# EAGLE design Bleasy (EAGLE 6.5.0)
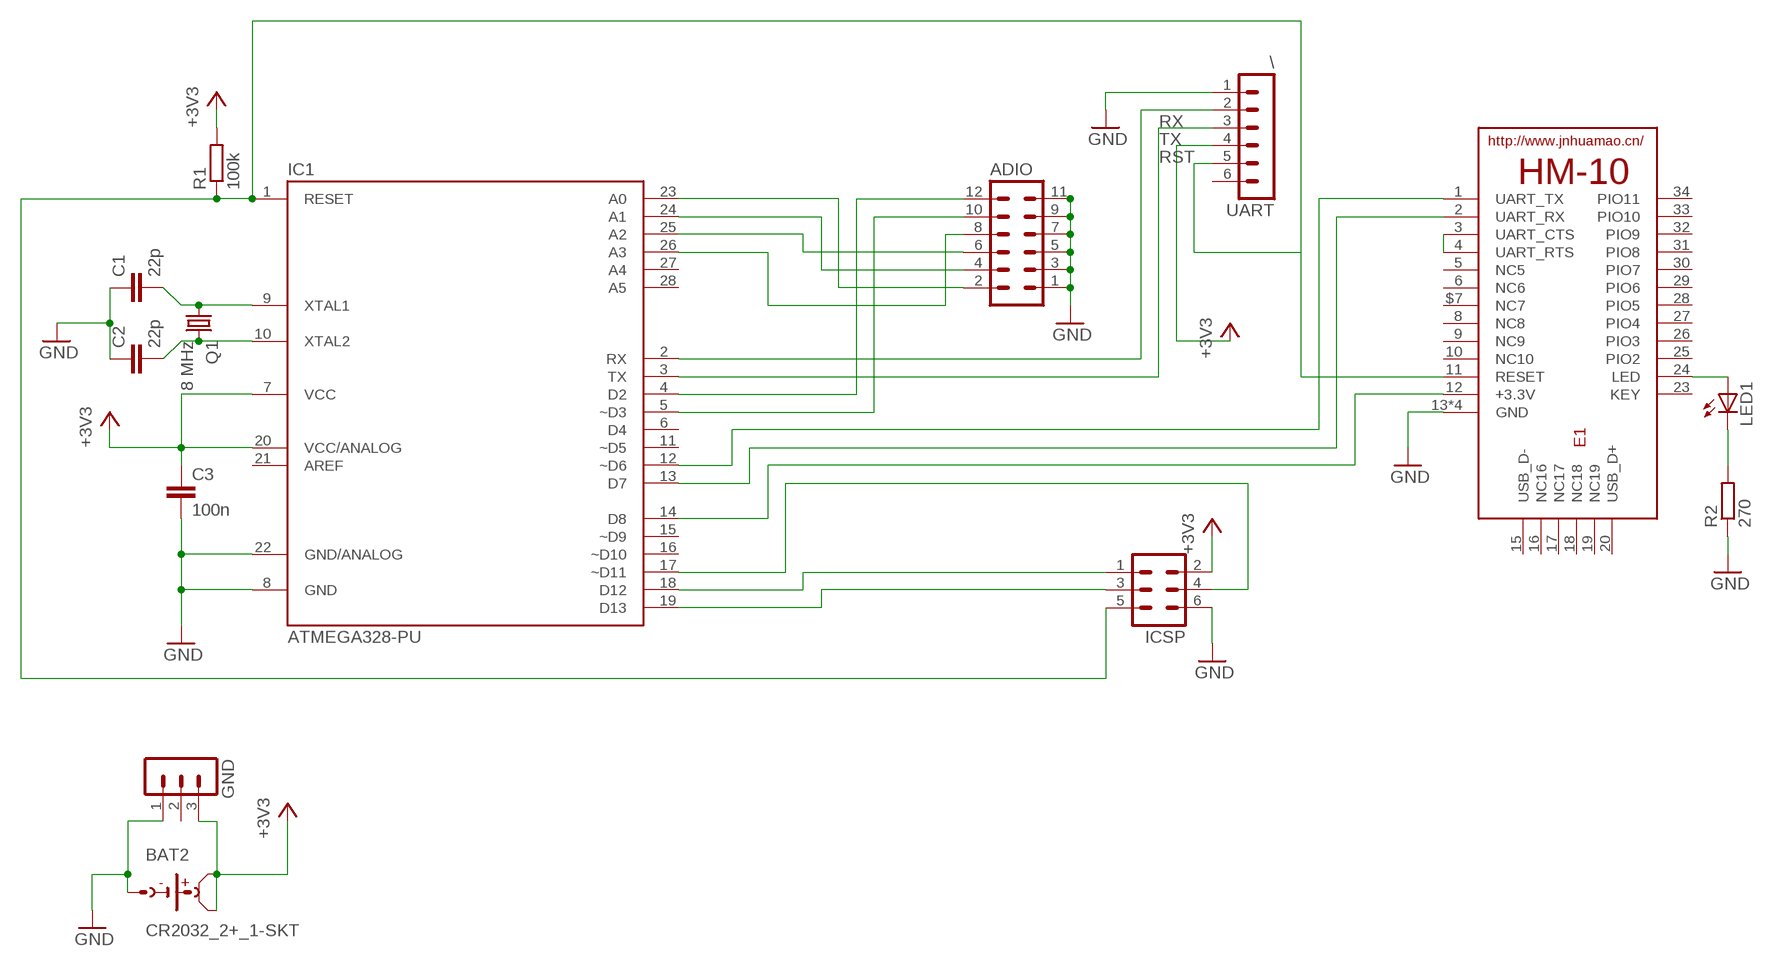
[diagram p0: schematic, sheet 1]

## Parts
ADIO  MA06-2  [MA06-2]
BAT2  CR2032_2+_1-SKT  [CR2032-SOCKET-THT]
C1  22p  C-EU025-025X050  [C025-025X050]
C2  22p  C-EU025-025X050  [C025-025X050]
C3  100n  C-EU025-025X050  [C025-025X050]
E1  HM-10-BOARD  [26.9X13X2.2_BOARD]
GND  MA03-1  [MA03-1]
IC1  ATMEGA328-PU  [DIL28-3]
ICSP  MA03-2  [MA03-2]
LED1  LED3MM  [LED3MM]
Q1  8 MHz  CRYSTALHC49U70  [HC49U70]
R1  100k  R-EU_R1206  [R1206]
R2  270  R-EU_R1206  [R1206]
UART  \  MA06-1  [MA06-1]

## Nets
+3V3: BAT2.2(POS2) BAT2.3(POS1) C3.1 GND.3 IC1.7(VCC) IC1.20(VCC/ANALOG) ICSP.2 R1.2 UART.4
GND: ADIO.1 ADIO.3 ADIO.5 ADIO.7 ADIO.9 ADIO.11 BAT2.1(NEG) C1.1 C2.1 C3.2 E1.13(GND) E1.14(GND) E1.21(GND) E1.22(GND) GND.1 IC1.8(GND) IC1.22(GND/ANALOG) ICSP.6 R2.1 UART.1
HM10_RX: E1.2(UART_RX) IC1.13(D7)
HM10_TX: E1.1(UART_TX) IC1.12(~D6)
MISO: IC1.18(D12) ICSP.1
N$1: C2.2 IC1.10(XTAL2) Q1.2
N$2: C1.2 IC1.9(XTAL1) Q1.1
N$3: IC1.17(~D11) ICSP.4
N$4: ADIO.12 IC1.4(D2)
N$5: ADIO.10 IC1.5(~D3)
N$6: E1.24(LED) LED1.A
N$7: LED1.K(C) R2.2
N$8: E1.12(+3.3V) IC1.14(D8)
N$9: ADIO.2 IC1.23(A0)
N$10: ADIO.4 IC1.24(A1)
N$11: ADIO.6 IC1.25(A2)
N$12: ADIO.8 IC1.26(A3)
N$13: E1.3(UART_CTS) E1.4(UART_RTS)
RST: E1.11(RESET) IC1.1(RESET) ICSP.5 R1.1 UART.5
RX: IC1.2(RX) UART.2
SCK: IC1.19(D13) ICSP.3
TX: IC1.3(TX) UART.3
Unconnected: E1.5(NC5) E1.6(NC6) E1.8(NC8) E1.9(NC9) E1.10(NC10) E1.15(USB_D-) E1.16(NC16) E1.17(NC17) E1.18(NC18) E1.19(NC19) E1.20(USB_D+) E1.23(KEY) E1.25(PIO2) E1.26(PIO3) E1.27(PIO4) E1.28(PIO5) E1.29(PIO6) E1.30(PIO7) E1.31(PIO8) E1.32(PIO9) E1.33(PIO10) E1.34(PIO11) E1.$7(NC7) GND.2 IC1.6(D4) IC1.11(~D5) IC1.15(~D9) IC1.16(~D10) IC1.21(AREF) IC1.27(A4) IC1.28(A5) UART.6

## Library data of the parts
ADIO = con-lstb:MA06-2: PIN HEADER; OC_FARNELL: unknown; OC_NEWARK: unknown
BAT2 = con_bat_2032__s_:CR2032_2+_1-
C1-C3 = rcl:C-EU: CAPACITOR, European symbol
E1 = JNHuaMao:HM-10: HM Bluetooth module use TI CC2540 or CC2541, Master and slave roles in one, transmission version and remote control version and PIO state acquisition functions in one, Support the AT command modify module parameters, Convenient and flexible.
GND = con-lstb:MA03-1: PIN HEADER; OC_FARNELL: unknown; OC_NEWARK: unknown
IC1 = ATMEGA328P:ATMEGA328-PU
ICSP = con-lstb:MA03-2: PIN HEADER; OC_FARNELL: unknown; OC_NEWARK: unknown
LED1 = led:LED: LED OSRAM: - CHIPLED LG R971, LG N971, LY N971, LG Q971, LY Q971, LO R971, LY R971 LH N974, LH R974 LS Q976, LO Q976, LY Q976 LO Q996 - Hyper CHIPLED LW Q18S LB Q993, LB Q99A, LB R99A - SideLED LS A670, LO A670, LY A670, LG A670, LP A670 LB A673, LV A673, LT A673, LW A673 LH A674 LY A675 LS A676, LA A676, LO A676, LY A676, LW A676 LS A679, LY A679, LG A679 - Hyper Micro SIDELED® LS Y876, LA Y876, LO Y876, LY Y876 LT Y87S - SmartLED LW L88C, LW L88S LB L89C, LB L89S, LG L890 LS L89K, LO L89K, LY L89K LS L896, LA L896, LO L896, LY L896 - TOPLED LS T670, LO T670, LY T670, LG T670, LP T670 LSG T670, LSP T670, LSY T670, LOP T670, LYG T670 LG T671, LOG T671, LSG T671 LB T673, LV T673, LT T673, LW T673 LH T674 LS T676, LA T676, LO T676, LY T676, LB T676, LH T676, LSB T676, LW T676 LB T67C, LV T67C, LT T67C, LS T67K, LO T67K, LY T67K, LW E67C LS E67B, LA E67B, LO E67B, LY E67B, LB E67C, LV E67C, LT E67C LW T67C LS T679, LY T679, LG T679 LS T770, LO T770, LY T770, LG T770, LP T770 LB T773, LV T773, LT T773, LW T773 LH T774 LS E675, LA E675, LY E675, LS T675 LS T776, LA T776, LO T776, LY T776, LB T776 LHGB T686 LT T68C, LB T68C - Hyper Mini TOPLED® LB M676 - Mini TOPLED Santana® LG M470 LS M47K, LO M47K, LY M47K Source: http://www.osram.convergy.de LUXEON: - LUMILED® LXK2-PW12-R00, LXK2-PW12-S00, LXK2-PW14-U00, LXK2-PW14-V00 LXK2-PM12-R00, LXK2-PM12-S00, LXK2-PM14-U00 LXK2-PE12-Q00, LXK2-PE12-R00, LXK2-PE12-S00, LXK2-PE14-T00, LXK2-PE14-U00 LXK2-PB12-K00, LXK2-PB12-L00, LXK2-PB12-M00, LXK2-PB14-N00, LXK2-PB14-P00, LXK2-PB14-Q00 LXK2-PR12-L00, LXK2-PR12-M00, LXK2-PR14-Q00, LXK2-PR14-R00 LXK2-PD12-Q00, LXK2-PD12-R00, LXK2-PD12-S00 LXK2-PH12-R00, LXK2-PH12-S00 LXK2-PL12-P00, LXK2-PL12-Q00, LXK2-PL12-R00 Source: www.luxeon.com KINGBRIGHT: KA-3528ASYC Source: www.kingbright.com
Q1 = crystal:CRYSTAL: CRYSTAL; OC_FARNELL: unknown; OC_NEWARK: unknown
R1 R2 = resistor:R-EU_: RESISTOR, European symbol
UART = con-lstb:MA06-1: PIN HEADER; OC_FARNELL: unknown; OC_NEWARK: unknown

## Board
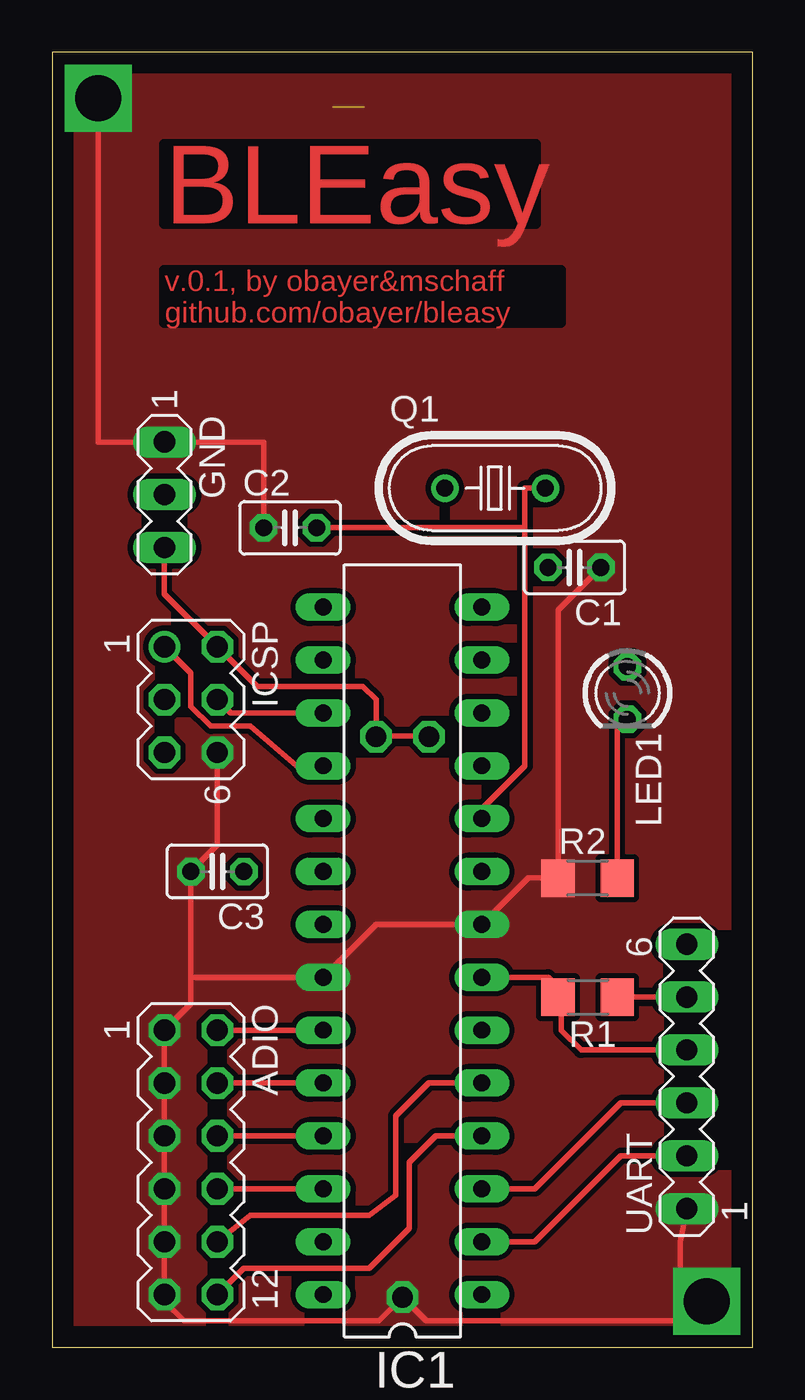
[diagram p1: board, top side]
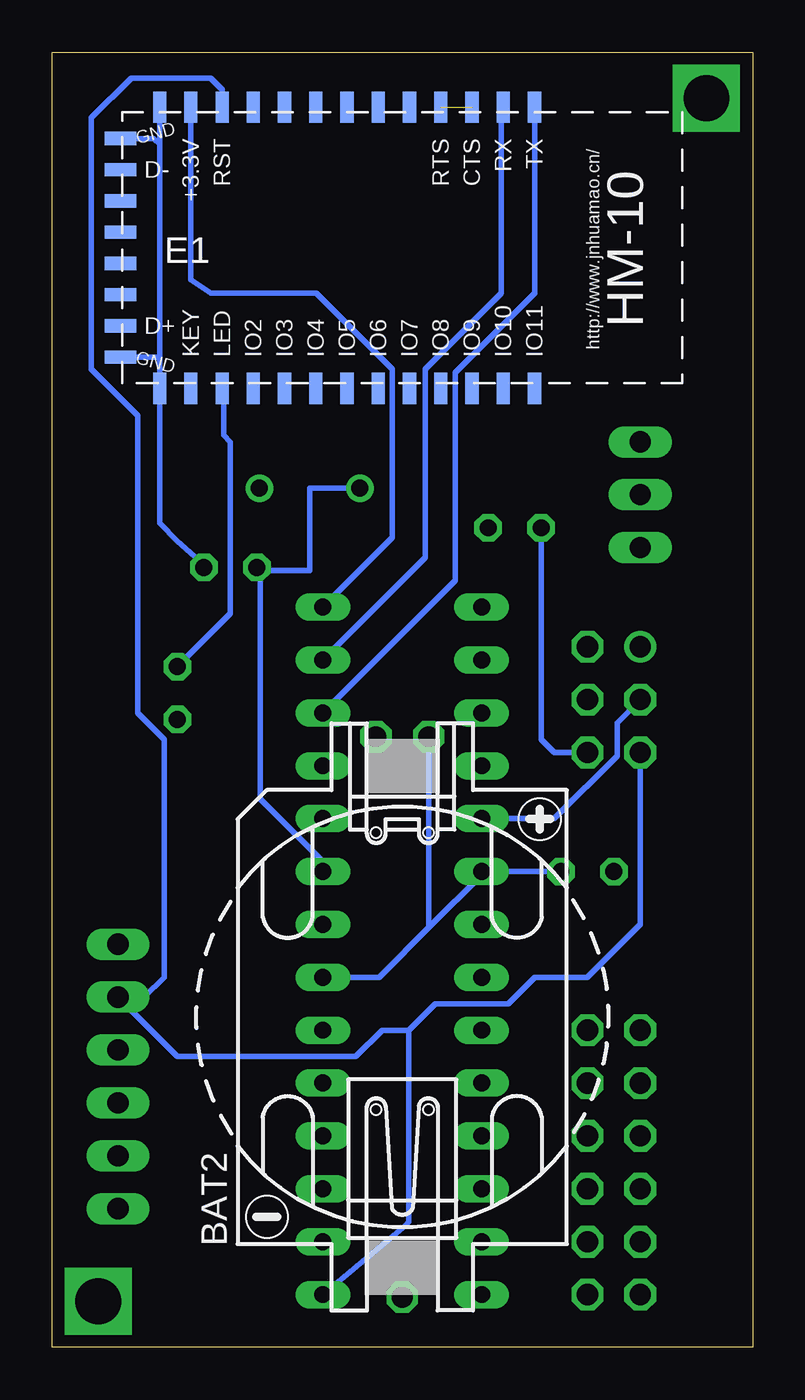
[diagram p2: board, bottom side, seen from below]

Size 33.64 x 62.22 mm. Coordinates in mm from the lower left corner, seen from the top.
Outline: 0,0 33.64,0 33.64,62.22 0,62.22 0,0
Copper layers (1*16): Top 0.035mm / dielectric 1.5mm / Bottom 0.035mm
Design rules "default": minimum track width 10mil, minimum drill 24mil, track to track 8mil, track to pad 8mil, pad to pad 8mil, via to via 8mil, smd to smd 8mil, copper to edge 40mil, drill to drill 8mil, minimum pad ring 10mil, minimum via ring 8mil, stop-mask expansion 4mil, vias tented up to drill 0mil, thermal gap 10mil

### Footprints (pad centres in the part's own frame; a part is rotated, then mirrored left to right if it is on the bottom)
MA06-2 = drill 1.016 octagon: 1 -6.35,-1.27; 2 -6.35,1.27; 3 -3.81,-1.27; 4 -3.81,1.27; 5 -1.27,-1.27; 6 -1.27,1.27; 7 1.27,-1.27; 8 1.27,1.27; 9 3.81,-1.27; 10 3.81,1.27; 11 6.35,-1.27; 12 6.35,1.27
CR2032-SOCKET-THT = drill 1 octagon: 1 -13.462,0; 2 13.462,-1.27; 3 13.462,1.27
C025-025X050 = drill 0.813 octagon: 1 -1.27,0; 2 1.27,0
26.9X13X2.2_BOARD = smd 1.5 x 0.635: 1 -7.5,0; 2 -7.5,-1.5; 3 -7.5,-3; 4 -7.5,-4.5; 5 -7.5,-6; 6 -7.5,-7.5; 8 -7.5,-10.5; 9 -7.5,-12; 10 -7.5,-13.5; 11 -7.5,-15; 12 -7.5,-16.5; 13 -7.5,-18; 22 6,-18; 23 6,-16.5; 24 6,-15; 25 6,-13.5; 26 6,-12; 27 6,-10.5; 28 6,-9; 29 6,-7.5; 30 6,-6; 31 6,-4.5; 32 6,-3; 33 6,-1.5; 34 6,0; $7 -7.5,-9 | smd 0.635 x 1.5: 14 -6,-19.875; 15 -4.5,-19.875; 16 -3,-19.875; 17 -1.5,-19.875; 18 0,-19.875; 19 1.5,-19.875; 20 3,-19.875; 21 4.5,-19.875
MA03-1 = drill 1.016 long: 1 -2.54,0; 2 0,0; 3 2.54,0
DIL28-3 = drill 0.813 long: 1 -16.51,-3.81; 2 -13.97,-3.81; 3 -11.43,-3.81; 4 -8.89,-3.81; 5 -6.35,-3.81; 6 -3.81,-3.81; 7 -1.27,-3.81; 8 1.27,-3.81; 9 3.81,-3.81; 10 6.35,-3.81; 11 8.89,-3.81; 12 11.43,-3.81; 13 13.97,-3.81; 14 16.51,-3.81; 15 16.51,3.81; 16 13.97,3.81; 17 11.43,3.81; 18 8.89,3.81; 19 6.35,3.81; 20 3.81,3.81; 21 1.27,3.81; 22 -1.27,3.81; 23 -3.81,3.81; 24 -6.35,3.81; 25 -8.89,3.81; 26 -11.43,3.81; 27 -13.97,3.81; 28 -16.51,3.81
MA03-2 = drill 1.016: 1 -2.54,-1.27 | drill 1.016 octagon: 2 -2.54,1.27; 3 0,-1.27; 4 0,1.27; 5 2.54,-1.27; 6 2.54,1.27
LED3MM = drill 0.813 octagon: A -1.27,0; K 1.27,0
HC49U70 = drill 0.813: 1 -2.413,0; 2 2.413,0
R1206 = smd 1.6 x 1.803: 1 -1.422,0; 2 1.422,0
MA06-1 = drill 1.016 long: 1 -6.35,0; 2 -3.81,0; 3 -1.27,0; 4 1.27,0; 5 3.81,0; 6 6.35,0

### Placement (x,y rotation side)
ADIO  6.67,8.89 270 top
BAT2  16.83,15.88 90 bottom
C1  25.08,37.47 180 top
C2  11.43,39.37 0 top
C3  7.94,22.86 180 top
E1  10.48,52.07 270 bottom
GND  5.4,40.96 270 top
IC1  16.83,19.05 90 top
ICSP  6.67,31.11 270 top
LED1  27.62,31.43 270 top
Q1  21.27,41.27 0 top
R1  25.72,16.83 180 top
R2  25.72,22.54 0 top
UART  30.48,13.02 90 top

### Tracks (layer width: path | path; a pad name or v marks a point on that pad's centre or on a via)
+3V3
  Top 0.254: GND.3 5.4,36.2 ICSP.2 9.84,31.75 14.92,31.75 15.56,31.11 15.56,29.37 | 15.56,29.37 18.1,29.37 BAT2.3 | 15.56,29.37 BAT2.2 | IC1.7 23.81,17.78 24.3,17.3 R1.2 | UART.4 25.4,14.29 24.45,15.24 24.45,16.68
  Top 0.406: 24.45,16.68 R1.2
  Bottom 0.254: IC1.7 17.94,17.78 15.48,20.24 | 15.48,20.24 13.02,22.7 IC1.20 C3.1 | BAT2.2 15.56,20.32 15.48,20.24
GND  (via drill 2.2)
  Top 0.254: C2.1 10.16,43.5 GND.1 2.22,43.5 v2.22,60.01 | ICSP.6 7.94,24.13 C3.2 6.67,17.78 | 30.16,1.27 17.97,1.27 BAT2.1 15.68,1.27 6.35,1.27 5.4,2.22 ADIO.11 ADIO.9 ADIO.7 ADIO.5 ADIO.3 ADIO.1 6.67,16.51 6.67,17.78 | C1.1 24.3,35.41 R2.1 22.86,22.54 IC1.8 15.56,20.32 IC1.22 6.67,17.78 | 30.16,1.27 30.16,5.08 UART.1 | 30.16,1.27 v31.43,2.22
  Bottom 0.254: E1.22 28.54,46.07 | C1.1 26.35,37.59 27.62,38.73 28.48,39.59 E1.22 | 30.3,47.62 E1.21 28.53,47.57 28.48,47.62 | E1.13 28.48,57.78 | 28.48,57.78 28.48,47.62 | 28.48,47.62 E1.22 | E1.14 28.76,58.07 28.48,57.78 | C2.1 10.16,29.21 9.53,28.57 ICSP.6
  pour Top (isolate 0.254, no thermals): 0.63,61.28 0.63,0.64 32.7,0.95 32.7,61.28
HM10_RX
  Bottom 0.254: IC1.13 15.72,37.94 15.72,46.99 12.06,50.64 12.06,58.9 E1.2
HM10_TX
  Bottom 0.254: E1.1 10.48,50.64 14.29,46.83 14.29,36.83 IC1.12
MISO
  Top 0.254: IC1.18 11.75,27.94 9.53,29.84 7.62,29.84 6.67,30.8 6.67,32.38 ICSP.1
N$1
  Top 0.254: IC1.10 20.64,25.88 22.7,27.94 22.7,39.37 | 22.7,39.37 22.7,41.27 Q1.2 | C2.2 22.7,39.37
N$2
  Bottom 0.254: IC1.9 20.64,23.34 23.65,26.35 23.65,37.31 | C1.2 23.65,37.31 | 23.65,37.31 21.27,37.31 21.27,41.27 Q1.1
N$3
  Top 0.254: IC1.17 8.57,30.48 ICSP.4
N$4
  Top 0.254: IC1.4 18.41,10.16 17.14,8.89 17.14,5.71 15.24,3.81 9.21,3.81 ADIO.12
N$5
  Top 0.254: IC1.5 18.1,12.7 16.51,11.11 16.51,7.3 15.24,6.35 9.53,6.35 ADIO.10
N$6
  Bottom 0.254: LED1.A 25.08,35.24 25.08,43.5 25.4,43.81 25.4,45.99 E1.24
N$7
  Top 0.254: R2.2 27.14,29.68 LED1.K
N$8
  Bottom 0.254: IC1.14 17.3,38.89 17.3,46.99 20.96,50.64 26.03,50.64 26.99,51.28 E1.12
N$9
  Top 0.254: ADIO.2 IC1.23
N$10
  Top 0.254: IC1.24 ADIO.4
N$11
  Top 0.254: ADIO.6 IC1.25
N$12
  Top 0.254: IC1.26 ADIO.8
N$13  (1 unrouted)
RST
  Top 0.254: UART.5 R1.1
  Bottom 0.254: IC1.1 16.67,5.87 16.51,6.03 16.51,15.24 | 16.51,15.24 15.24,16.51 11.75,16.51 10.48,17.78 7.94,17.78 5.4,20.32 ICSP.5 | 16.51,15.24 17.78,15.24 19.05,13.97 27.62,13.97 UART.5 29.21,16.83 28.26,17.78 28.26,29.21 29.53,30.48 29.53,44.77 31.75,46.99 31.75,59.05 29.85,60.96 26.03,60.96 25.48,60.4 E1.11
RX
  Top 0.254: UART.2 27.31,9.21 23.18,5.08 IC1.2
SCK
  Bottom 0.254: IC1.19 9.53,25.4 6.51,28.42 6.51,30 ICSP.3
TX
  Top 0.254: UART.3 27.31,11.75 23.18,7.62 IC1.3

### Text on the board
Top: BLEasy | v.0.1, by obayer&mschaff / github.com/obayer/bleasy